# Altium schematic sheet Sheet1.SchDoc
size A4; SheetNumber: 1; SheetTotal: 1
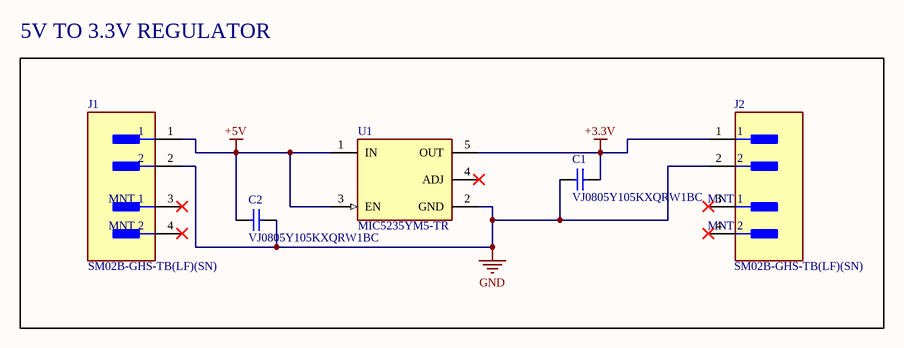
[diagram p0: Sheet1.SchDoc]

## Parts
C1  VJ0805Y105KXQRW1BC  [CAPC2013X145X50NL20T20]
C2  VJ0805Y105KXQRW1BC  [CAPC2013X145X50NL20T20]
J1  SM02B-GHS-TB(LF)(SN)  [FP-SM02B-GHS-TB_LF_SN-MFG]
J2  SM02B-GHS-TB(LF)(SN)  [FP-SM02B-GHS-TB_LF_SN-MFG]
U1  MIC5235YM5-TR  [FP-SOT23-5LD-PL-1-MFG]

## Blocks framed on the sheet
5V TO 3.3V REGULATOR: C1 C2 J1 J2 U1

## Nets
+3.3V: C1.2 J2.1 U1.5(OUT)
+5V: C2.1 J1.1 U1.1(IN) U1.3(EN)
GND: C1.1 C2.2 J1.2 J2.2 U1.2(GND)

Not connected (* = marked no-connect by the designer): J1 3(MNT_1)* 4(MNT_2)*; J2 3(MNT_1)* 4(MNT_2)*; U1 4(ADJ)*

## Library data of the parts
C1 C2 = CMP-2007-01676-1: Manufacturer: Vitramon; Part Number: VJ0805Y105KXQRW1BC
J1 J2 = CMP-2000-07076-2: CONN HEADER SMD R/A 2POS 1.25MM; Voltage Rating: 50V; Number of Positions: 2; Pitch: 0.049inch; Current Rating: 1A; Connector Type: Outer Shroud Contact; Number of Rows: 1; Contact Material: Bronze; Termination: Solder; Color: Natural; Package Quantity: 2500; Mount: Surface Mount; Housing Color: Natural; Number of Contacts: 2; Packaging: Tape and Reel; Lead Free: Lead Free; Housing Material: Nylon; Orientation: Right Angle; Contact Type: Male Pin; Contact Plating: Tin; Series: GH; Fastening Type: Latch
U1 = CMP-06324-000004-1: IC REG LIN POS ADJ 150MA SOT23-5; Manufacturer: Microchip Technology; Number Of Outputs: 1; Max Junction Temp: +125°C; Output Voltage: 1.24-20V; Description: LDO Regulator Pos 1.24V to 20V 0.15A 5-Pin SOT-23 T/R; Max Supply Voltage: 24V; Nominal Supply Current: 18-2000uA; Output Type: AdjustableProgrammable; Standoff Height: 0mm; Dropout Voltage: 310mV; Min Supply Voltage: 2.3V; Accuracy Percentage: 1%; Package: SOT23-5LD-PL-1; ComponentLink2Description: Datasheet; Temperature: -40°C to +125°C; Category: IC; ComponentLink2URL: http://ww1.microchip.com/downloads/en/DeviceDoc/mic5235.pdf; Manufacturer Part Number: MIC5235YM5-TR; Device Class L3: Voltage Regulators - Linear; Temperature Range High: +125°C; Digikey Description: IC REG LIN POS ADJ 150MA SOT23-5; Ipc Land Pattern Name: SOT95P280X118-5; Output Current: 150mA; Height: 1.45mm; Mouser Description: Low Dropout Regulators - LDO High Vin, Low Iq Regulator (Lead Free); Temperature Range Low: -40°C; Automotive: No; Device Class L2: Power Management ICs; RoHS: TRUE; Lead Free: Yes; Octopart: https://octopart.com/mic5235ym5-tr-microchip-66802314; Device Class L1: Integrated Circuits (ICs)